# EasyEDA Pro project Type_C硬盘盒_2025-09-27_14-32-02.eprj, board PCB_ver3.0
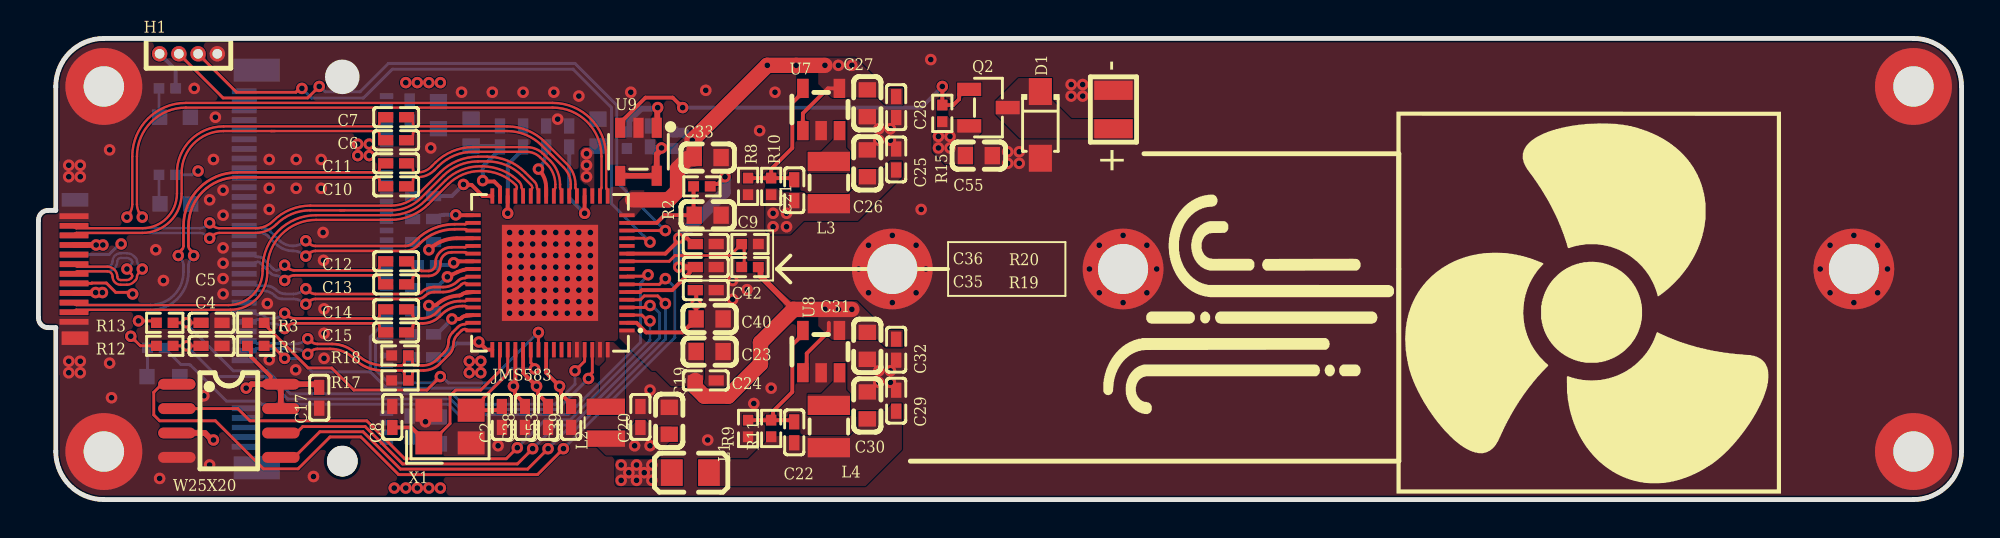
[diagram p7: board, top side]
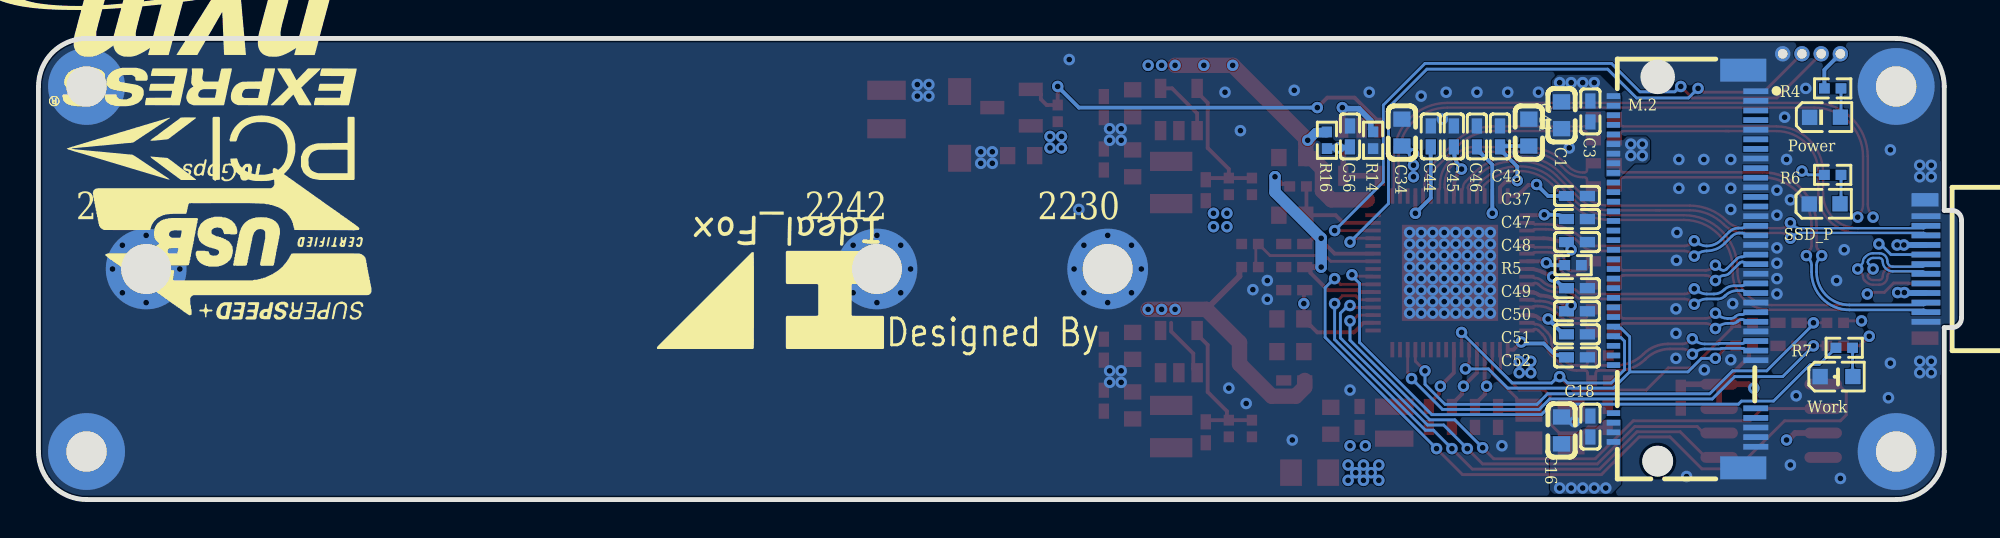
[diagram p8: board, bottom side, seen from below]

Outline 100 x 24 mm; copper layers: Top Layer, GND, VCC, Bottom Layer. Coordinates in mm from the lower left corner of the outline.
Outline path: 0,14.55 arc(0.15,14.9) 0.5,15.05 0.9,15.05 0.9,21.5 arc(1.63,23.27) 3.4,24 97.5,24 arc(99.27,23.27) 100,21.5 100,2.5 arc(99.27,0.73) 97.5,0 3.4,0 arc(1.63,0.73) 0.9,2.5 0.9,8.95 0.5,8.95 arc(0.15,9.1) 0,9.45 0,14.55
Stack: Top Layer 0.035mm / Dielectric 1 0.0711mm PP-006 er 4.1 / GND 0.018mm / Dielectric1 0.32mm FR-4 er 4.8 / VCC 0.018mm / Dielectric 2 0.0711mm PP-006 er 4.1 / Bottom Layer 0.035mm

## Design rules (mm)
net N_P1_TX_P: N_P1_TX
net N_P1_TX_N: N_P1_TX
net N_P0_TX_P: N_P0_TX
net N_P0_TX_N: N_P0_TX
net U_TX2_P: U_TX2
net U_TX2_N: U_TX2
net U_TX1_P: U_TX1
net U_TX1_N: U_TX1
net TX2_P: TX2
net TX2_N: TX2
net TX1_P: TX1
net TX1_N: TX1
net RX2_P: RX2
net RX2_N: RX2
net RX1_P: RX1
net RX1_N: RX1
net P1_TX_P: P1_TX
net P1_TX_N: P1_TX
net P1_RX_P: P1_RX
net P1_RX_N: P1_RX
net P0_TX_P: P0_TX
net P0_TX_N: P0_TX
net P0_RX_P: P0_RX
net P0_RX_N: P0_RX
net D_P: D
net D_N: D
net CLK_P: CLK
net CLK_N: CLK
spacing copperThickness2oz_1: track to track 0.12, other pairs 0 to 0.3
spacing copperThickness1oz_1: track to track 0.12, other pairs 0 to 0.3
spacing copperThickness1oz: track to track 0.12, other pairs 0 to 0.3
spacing Stitching GND: track to track 0.2, other pairs 0 to 0.3
spacing safeClearance (default): track to track 0.12, other pairs 0 to 0.3
track width copperThickness1oz_2 (default): min 0.1, default 0.1, max 5
differential pair DiffPairsRouting_85oum: width min 0.1, default 0.1, max 0.381; gap min 0.1, default 0.1
differential pair DiffPairsRouting_90oum (default): width min 0.1, default 0.1, max 0.381; gap min 0.1, default 0.1
via viaSize (default): diameter min 0.6, default 0.6, max 10; hole min 0.3, default 0.3, max 6.3
net GND uses Stitching GND

## Placement (name value [footprint] x y rotation side)
C1  -  [C0603]  20.8 20 270 bottom
C2  -  [C0402]  24.1 4.3 90 top
C3  -  [C0402]  19.3 20.2 90 bottom
C4  -  [C0402]  9 8 0 top
C5  -  [C0402]  9 9.2 0 top
C6  -  [C0402]  18.6 18.7 0 top
C7  -  [C0402]  18.6 19.9 0 top
C8  -  [C0402]  18.4 4.3 270 top
C9  -  [C0603]  34.8 14.8 180 top
C10  -  [C0402]  18.6 16.3 0 top
C11  -  [C0402]  18.6 17.5 0 top
C12  -  [C0402]  18.6 12.4 180 top
C13  -  [C0402]  18.6 11.2 180 top
C14  -  [C0402]  18.6 9.9 180 top
C15  -  [C0402]  18.6 8.7 180 top
C16  -  [C0603]  20.8 3.6 90 bottom
C17  -  [C0402]  14.6 5.3 90 top
C18  -  [C0402]  19.3 3.8 270 bottom
C19  -  [C0603]  32.8 4.1 270 top
C20  -  [C0402]  31.3 4.3 270 top
C21  -  [C0402]  39.3 16.1 90 top
C22  -  [C0402]  39.3 3.5 90 top
C23  -  [C0603]  34.9 7.7 180 top
C24  -  [C0402]  34.7 6.2 180 top
C25  -  [C0402]  44.6 17.7 270 top
C26  -  [C0603]  43.1 17.5 270 top
C27  -  [C0603]  43.1 20.62 90 top
C28  -  [C0402]  44.6 20.42 90 top
C29  -  [C0402]  44.6 5.14 270 top
C30  -  [C0603]  43.1 4.9 270 top
C31  -  [C0603]  43.1 8 90 top
C32  -  [C0402]  44.6 7.8 90 top
C33  -  [C0603]  34.8 17.8 180 top
C34  -  [C0603]  29.1 19.1 270 bottom
C35  -  [C0402]  34.7 12.1 180 top
C36  -  [C0402]  34.7 13.3 180 top
C37  -  [C0402]  20 15.8 0 bottom
C38  -  [C0402]  25.3 4.3 90 top
C39  -  [C0402]  27.7 4.3 90 top
C40  -  [C0603]  34.9 9.4 180 top
C41  -  [C0603]  22.5 19.1 270 bottom
C42  -  [C0402]  34.7 10.9 180 top
C43  -  [C0402]  24 18.9 270 bottom
C44  -  [C0402]  27.6 18.9 270 bottom
C45  -  [C0402]  26.4 18.9 270 bottom
C46  -  [C0402]  25.2 18.9 270 bottom
C47  -  [C0402]  20 14.6 0 bottom
C48  -  [C0402]  20 13.4 0 bottom
C49  -  [C0402]  20 11 0 bottom
C50  -  [C0402]  20 9.8 0 bottom
C51  -  [C0402]  20 8.6 0 bottom
C52  -  [C0402]  20 7.4 0 bottom
C53  -  [C0402]  26.5 4.3 90 top
C55  -  [C0603]  48.9 17.9 180 top
C56  -  [C0402]  31.8 18.9 90 bottom
D1  -  [SOD-123FL_L2.7-W1.8-LS3.8-RD]  52.1 19.5 270 top
Designator10  -  [M2_HOLE]  3.4 21.5 0 top
Designator17  -  [M2_HOLE]  97.5 21.5 0 top
Designator19  -  [M2_HOLE]  97.5 2.5 0 top
Designator20  -  [M2_HOLE]  3.4 2.5 0 top
H1  -  [HDR-TH_ZX-PZ1.0-1-4PZZ]  7.8 23.2 0 top
JMS583  -  [QFN-64_L8.0-W8.0-P0.40-TL-EP6.0]  26.6 11.8 180 top
L1  -  [L0805]  33.9 1.4 180 top
L2  -  [IND-SMD_L2.5-W2.0-VLS252012CX-150M]  29.5 4 90 top
L3  -  [IND-SMD_L2.5-W2.0_MHCHL2520]  41.1 16.5 90 top
L4  -  [IND-SMD_L2.5-W2.0_MHCHL2520]  41.1 3.8 90 top
M.2  -  [CONN-SMD_91302-225-067RCM]  14.4 12 270 bottom
NOREF  -  [Pad_ie502]  94.4 12 0 top
NOREF#2  -  [Pad_ie501]  56.4 12 0 top
NOREF#3  -  [Pad_ie498]  55.9 19.3 90 top
NOREF#4  -  [Pad_ie500]  44.4 12 0 top
NOREF#5  -  [Pad_ie499]  55.9 21.3 90 top
Power  -  [LED0603-RD_GREEN]  7.1 19.9 180 bottom
Q2  -  [SOT-23-3_L2.9-W1.3-P1.90-LS2.4-BR]  49.4 20.4 180 top
R1  -  [R0402]  11.3 8 180 top
R2  -  [R0402]  34.5 16.3 180 top
R3  -  [R0402]  11.3 9.2 180 top
R4  -  [R0402]  6.7 21.4 180 bottom
R5  -  [R0402]  20.2 12.2 180 bottom
R6  -  [R0402]  6.7 16.9 180 bottom
R7  -  [R0402]  6.1 7.9 180 bottom
R8  -  [R0402]  36.9 16.3 90 top
R9  -  [R0402]  36.9 3.7 90 top
R10  -  [R0402]  38.1 16.3 270 top
R11  -  [R0402]  38.1 3.7 270 top
R12  -  [R0402]  6.57 8 0 top
R13  -  [R0402]  6.57 9.2 0 top
R14  -  [R0402]  30.6 18.7 90 bottom
R15  -  [R0402]  47 20.1 90 top
R16  -  [R0402]  33 18.7 270 bottom
R17  -  [R0402]  18.8 6.2 180 top
R18  -  [R0402]  18.8 7.5 180 top
R19  -  [R0402]  37 12.1 180 top
R20  -  [R0402]  37 13.3 0 top
SSD_P  -  [LED0603-RD_GREEN]  7.12 15.39 180 bottom
U7  -  [SOT-23-5_L2.9-W1.6-P0.95-LS2.8-BL]  40.7 20.3 0 top
U8  -  [SOT-23-5_L2.9-W1.6-P0.95-LS2.8-BL]  40.7 7.7 0 top
U9  -  [SOT-23-5_L3.0-W1.5-P0.95-LS2.8-BL]  31.2 18.1 180 top
USB1  -  [USB-TYPE-C-SMD_U261-241N-4BS60]  1.88 12 90 bottom
W25X20  -  [SOIC-8_L5.0-W4.0-P1.27-LS6.0-BL]  9.9 4.1 270 top
Work  -  [LED0603-R-RD]  6.5 6.4 180 bottom
X1  -  [CRYSTAL-SMD_4P-L3.2-W2.5-BL]  21.4 3.8 0 top

## Footprints (pads in the part's own frame, mm; a bottom-side part is the same pattern mirrored in y, then rotated)
C0402
  rect 0.79x0.54 smd: 1(-0.545,0) 2(0.545,0)
C0603
  rect 0.8x0.9 smd: 1(-0.7,0) 2(0.7,0)
CONN-SMD_91302-225-067RCM
  rect 0.3x1.3 smd: 1(-9.25,3.7) 3(-8.75,3.7) 5(-8.25,3.7) 7(-7.75,3.7) 9(-7.25,3.7) 11(-6.75,3.7) 13(-6.25,3.7) 15(-5.75,3.7) 17(-5.25,3.7) 19(-4.75,3.7) 21(-4.25,3.7) 23(-3.75,3.7) 25(-3.25,3.7) 27(-2.75,3.7) 29(-2.25,3.7) 31(-1.75,3.7) 33(-1.25,3.7) 35(-0.75,3.7) 37(-0.25,3.7) 39(0.25,3.7) 41(0.75,3.7) 43(1.25,3.7) 45(1.75,3.7) 47(2.25,3.7) 49(2.75,3.7) 51(3.25,3.7) 53(3.75,3.7) 55(4.25,3.7) 57(4.75,3.7) 67(7.25,3.7) 69(7.75,3.7) 71(8.25,3.7) 73(8.75,3.7) 75(9.25,3.7)
  rect 0.3x0.7 smd: 2(-9,-3.7) 4(-8.5,-3.7) 6(-8,-3.7) 8(-7.5,-3.7) 10(-7,-3.7) 12(-6.5,-3.7) 14(-6,-3.7) 16(-5.5,-3.7) 18(-5,-3.7) 20(-4.5,-3.7) 22(-4,-3.7) 24(-3.5,-3.7) 26(-3,-3.7) 28(-2.5,-3.7) 30(-2,-3.7) 32(-1.5,-3.7) 34(-1,-3.7) 36(-0.5,-3.7) 38(0,-3.7) 40(0.5,-3.7) 42(1,-3.7) 44(1.5,-3.7) 46(2,-3.7) 48(2.5,-3.7) 50(3,-3.7) 52(3.5,-3.7) 54(4,-3.7) 56(4.5,-3.7) 58(5,-3.7) 68(7.5,-3.7) 70(8,-3.7) 72(8.5,-3.7) 74(9,-3.7)
  rect 1.2x2.4 smd: 76(-10.35,3.05) 77(10.35,3.05)
CRYSTAL-SMD_4P-L3.2-W2.5-BL
  rect 1.4x1.2 smd: 1(-1.1,-0.85) 2(1.1,-0.85) 3(1.1,0.85) 4(-1.1,0.85)
HDR-TH_ZX-PZ1.0-1-4PZZ
  round 0.8 hole 0.5: 1(-1.5,0) 2(-0.5,0) 3(0.5,0) 4(1.5,0)
IND-SMD_L2.5-W2.0-VLS252012CX-150M
  rect 0.85x2 smd: 1(-0.83,0) 2(0.83,0)
IND-SMD_L2.5-W2.0_MHCHL2520
  rect 1x2.2 smd: 1(-1.1,0) 2(1.1,0)
L0805
  rect 1.133x1.377 smd: 1(-0.966,0) 2(0.966,0)
LED0603-R-RD
  rect 0.8x0.8 smd: 1(0.851,0) 2(-0.851,0)
LED0603-RD_GREEN
  rect 0.8x0.8 smd: 1(-0.799,-0.004) 2(0.799,0.004)
M2_HOLE
  round 4 hole 2.1: 16(0,0)
Pad_ie498
  rect 1x2 smd: 1(0,0)
Pad_ie499
  rect 1x2 smd: 2(0,0)
Pad_ie500
  round 4.2 hole 2.6: 16(0,0)
Pad_ie501
  round 4.2 hole 2.6: 16(0,0)
Pad_ie502
  round 4.2 hole 2.6: 16(0,0)
QFN-64_L8.0-W8.0-P0.40-TL-EP6.0
  rect 0.8x0.2 smd: 1(-4,3) 2(-4,2.6) 3(-4,2.2) 4(-4,1.8) 5(-4,1.4) 6(-4,1) 7(-4,0.6) 8(-4,0.2) 9(-4,-0.2) 10(-4,-0.6) 11(-4,-1) 12(-4,-1.4) 13(-4,-1.8) 14(-4,-2.2) 15(-4,-2.6) 16(-4,-3) 33(4,-3) 34(4,-2.6) 35(4,-2.2) 36(4,-1.8) 37(4,-1.4) 38(4,-1) 39(4,-0.6) 40(4,-0.2) 41(4,0.2) 42(4,0.6) 43(4,1) 44(4,1.4) 45(4,1.8) 46(4,2.2) 47(4,2.6) 48(4,3)
  rect 0.2x0.8 smd: 17(-3,-4) 18(-2.6,-4) 19(-2.2,-4) 20(-1.8,-4) 21(-1.4,-4) 22(-1,-4) 23(-0.6,-4) 24(-0.2,-4) 25(0.2,-4) 26(0.6,-4) 27(1,-4) 28(1.4,-4) 29(1.8,-4) 30(2.2,-4) 31(2.6,-4) 32(3,-4) 49(3,4) 50(2.6,4) 51(2.2,4) 52(1.8,4) 53(1.4,4) 54(1,4) 55(0.6,4) 56(0.2,4) 57(-0.2,4) 58(-0.6,4) 59(-1,4) 60(-1.4,4) 61(-1.8,4) 62(-2.2,4) 63(-2.6,4) 64(-3,4)
  rect 5x5 smd: 65(0,0)
R0402
  rect 0.566x0.54 smd: 1(-0.433,0) 2(0.433,0)
SOD-123FL_L2.7-W1.8-LS3.8-RD
  rect 1.4x1.2 smd: 1(-1.735,0) 2(1.735,0)
SOIC-8_L5.0-W4.0-P1.27-LS6.0-BL
  oval 0.569x1.95 smd: 1(-1.905,-2.705) 2(-0.635,-2.705) 3(0.635,-2.705) 4(1.905,-2.705) 5(1.905,2.705) 6(0.635,2.705) 7(-0.635,2.705) 8(-1.905,2.705)
SOT-23-3_L2.9-W1.3-P1.90-LS2.4-BR
  rect 1.25x0.7 smd: 1(1,-0.95) 2(1,0.95) 3(-1,0)
SOT-23-5_L2.9-W1.6-P0.95-LS2.8-BL
  rect 0.6x1 smd: 1(-0.95,-1.1) 2(0,-1.1) 3(0.95,-1.1) 4(0.95,1.1) 5(-0.95,1.1)
SOT-23-5_L3.0-W1.5-P0.95-LS2.8-BL
  rect 0.532x1.045 smd: 1(-0.95,-1.25) 2(0,-1.25) 3(0.95,-1.25) 4(0.95,1.25) 5(-0.95,1.25)
USB-TYPE-C-SMD_U261-241N-4BS60
  rect 0.7x1.4 smd far side: 1(-3.6,0.025)
  rect 0.7x1.4 smd: 2(3.6,0.025)
  rect 0.3x1.5 smd: A1(2.75,-0.025) A2(2.25,-0.025) A3(1.75,-0.025) A4(1.25,-0.025) A5(0.75,-0.025) A6(0.25,-0.025) A7(-0.25,-0.025) A8(-0.75,-0.025) A9(-1.25,-0.025) A10(-1.75,-0.025) A11(-2.25,-0.025) A12(-2.75,-0.025)
  rect 0.3x1.5 smd far side: B1(-2.75,-0.025) B2(-2.25,-0.025) B3(-1.75,-0.025) B4(-1.25,-0.025) B5(-0.75,-0.025) B6(-0.25,-0.025) B7(0.25,-0.025) B8(0.75,-0.025) B9(1.25,-0.025) B10(1.75,-0.025) B11(2.25,-0.025) B12(2.75,-0.025)

## Nets
3V3: C22.1 C29.2 C30.2 L1.1 L4.1 R11.2
AVDDL: C19.2 C20.2 C21.1 C25.2 C26.2 C40.2 C41.2 C42.2 C43.2 C44.2 C45.2 C46.2 C47.2 C48.2 C49.2 C50.2 C51.2 C52.2 C53.2 JMS583.2 JMS583.20 JMS583.25 JMS583.30 JMS583.31 JMS583.33 JMS583.36 JMS583.40 JMS583.43 JMS583.46 JMS583.49 JMS583.53 L2.1 L3.1 R10.2
GND: C1.2 C2.1 C3.1 C4.2 C5.2 C8.1 C9.1 C16.2 C17.1 C18.1 C19.1 C20.1 C23.1 C24.1 C25.1 C26.1 C27.1 C28.1 C29.1 C30.1 C31.1 C32.1 C33.1 C34.1 C35.1 C36.1 C37.1 C38.1 C39.1 C40.1 C41.1 C42.1 C43.1 C44.1 C45.1 C46.1 C47.1 C48.1 C49.1 C50.1 C51.1 C52.1 C53.1 C55.1 C56.2 D1.2 Designator10.16 Designator17.16 Designator19.16 Designator20.16 H1.4 JMS583.60 JMS583.63 JMS583.65 M.2.1 M.2.3 M.2.9 M.2.15 M.2.21 M.2.27 M.2.33 M.2.39 M.2.45 M.2.51 M.2.57 M.2.71 M.2.73 M.2.75 M.2.76 M.2.77 NOREF.16 NOREF#2.16 NOREF#4.16 NOREF#5.2 Power.1 R3.2 R5.2 R8.1 R9.1 R14.1 R17.2 R18.2 R20.2 SSD_P.1 U7.2 U8.2 U9.2 USB1.1 USB1.2 USB1.A1 USB1.A12 USB1.B1 USB1.B12 W25X20.4 Work.2 X1.2 X1.4
VBUS: C23.2 C24.2 C27.2 C28.2 C31.2 C32.2 C33.2 C55.2 JMS583.1 JMS583.16 Q2.2 R15.1 R16.1 R19.1 U7.1 U7.4 U8.1 U8.4 USB1.A4 USB1.A9 USB1.B4 USB1.B9
VCC: C17.2 C34.2 C35.2 C36.2 C37.2 C38.2 C39.2 H1.1 JMS583.6 JMS583.11 JMS583.19 JMS583.32 JMS583.52 JMS583.56 R1.2 R2.1 R4.1 W25X20.3 W25X20.7 W25X20.8
CC1: C4.1 JMS583.62 R12.2
CC2: C5.1 JMS583.61 R13.2
CLK_N: JMS583.47 M.2.53 R18.1
CLK_P: JMS583.48 M.2.55 R17.1
D_N: JMS583.17 USB1.A7 USB1.B7
D_P: JMS583.18 USB1.A6 USB1.B6
GPIO0: JMS583.3 W25X20.2
GPIO1: JMS583.4 W25X20.6
GPIO2: JMS583.5 W25X20.5
GPIO3: JMS583.7 W25X20.1
GPIO4: JMS583.8 R7.1
GPIO6: JMS583.10 R19.2 R20.1
GPIO8: H1.3 JMS583.13
GPIO9: H1.2 JMS583.14
LXO: JMS583.64 L2.2
M.2_3V3: C1.1 C3.2 C16.1 C18.2 L1.2 M.2.2 M.2.4 M.2.12 M.2.14 M.2.16 M.2.18 M.2.70 M.2.72 M.2.74 R6.1
N_P0_TX_N: C14.2 M.2.47
N_P0_TX_P: C15.2 M.2.49
N_P1_TX_N: C12.2 M.2.35
N_P1_TX_P: C13.2 M.2.37
P0_RX_N: JMS583.41 M.2.41
P0_RX_P: JMS583.42 M.2.43
P0_TX_N: C14.1 JMS583.44
P0_TX_P: C15.1 JMS583.45
P1_RX_N: JMS583.34 M.2.29
P1_RX_P: JMS583.35 M.2.31
P1_TX_N: C12.1 JMS583.37
P1_TX_P: C13.1 JMS583.38
PCIE_CLK: JMS583.55 M.2.52 R3.1
PCIE_RST: JMS583.54 M.2.50 R1.1
RST: C9.2 JMS583.15 R2.2
RX1_N: JMS583.27 USB1.A3
RX1_P: JMS583.26 USB1.A2
RX2_N: JMS583.28 USB1.B3
RX2_P: JMS583.29 USB1.B2
TX1_N: C6.2 JMS583.22
TX1_P: C7.2 JMS583.21
TX2_N: C11.2 JMS583.23
TX2_P: C10.2 JMS583.24
U_CC1: R12.1 USB1.A5
U_CC2: R13.1 USB1.B5
U_TX1_N: C6.1 USB1.B10
U_TX1_P: C7.1 USB1.B11
U_TX2_N: C11.1 USB1.A10
U_TX2_P: C10.1 USB1.A11
XIN: C8.2 JMS583.50 X1.1
XOUT: C2.2 JMS583.51 X1.3
$1N3363: R6.2 SSD_P.2
$1N3561: R7.2 Work.1
$1N4495: JMS583.39 R5.1
$1N10279: C22.2 R9.2 R11.1 U8.5
$1N10317: L4.2 U8.3
$1N10953: Power.2 R4.2
$1N11538: L3.2 U7.3
$1N11540: C21.2 R8.2 R10.1 U7.5
$1N22897: R14.2 U9.1
$1N22946: C56.1 R16.2 U9.4 U9.5
$1N23051: Q2.1 R15.2 U9.3
$1N23334: D1.1 NOREF#3.1 Q2.3

Pads without a net: JMS583 9 12 57 58 59; M.2 5 6 7 8 10 11 13 17 19 20 22 23 24 25 26 28 30 32 34 36 38 40 42 44 46 48 54 56 58 67 68 69; USB1 A8 B8

## Via types
v1: diameter 0.6, hole 0.3, Top Layer to Bottom Layer, 288 vias

## Routing (per net, layer and track width the routed paths; a pad name or vN(x,y) marks a point on that pad's centre or on a via; arc(x,y) is an arc through that point)
AVDDL: length 97.2
  Top Layer w0.2: JMS583.33 21.7,14.8 v1(21.7,14.82) ; JMS583.2 31.1,9.2 31.6,8.7 33.5,8.7 33.85,9.05 33.9,9.05 34.2,9.35 C40.2 34.2,10.86 C42.2 ; v1(20.3,10.1) 20.57,10.1 arc(20.65,10.11) 20.71,10.15 arc(21.26,10.49) 21.89,10.62 arc(21.96,10.64) 22.02,10.68 arc(22.09,10.72) 22.17,10.75 JMS583.43 ; C53.2 26.5,4.97 25.98,5.49 25.98,5.82 v1(25.9,5.9) 25.2,6.6 JMS583.53 ; JMS583.31 24,16.25 23.7,16.55 23.15,16.55 v1(23.1,16.6) ; JMS583.46 22.17,9.55 arc(22.08,9.52) 22.01,9.47 arc(21.95,9.42) 21.87,9.4 v1(21.5,9.4) ; v1(28.4,14.9) JMS583.20 ; v1(22.9,8.2) 23.3,7.8 JMS583.49 ; JMS583.36 21.75,13.6 arc(20.96,13.44) v1(20.3,13) ; v1(24.4,14.9) JMS583.30 ; v1(21.26,11.59) 21.77,11.83 arc(21.93,11.9) 22.1,11.95 22.3,12 JMS583.40 ; JMS583.25 26.4,16.23 arc(26.3,16.76) v1(26,17.2)
  VCC w0.6: v1(25.9,5.9) 26.08,6.08 26.1,6.08 26.52,6.5 26.52,7.1 26.1,7.52 24.28,7.52 22.9,8.9 v1(22.9,8.2)
  VCC w0.8: v1(31,2.8) v1(31.8,2.8) ; 21.15,10.85 21.05,10.85 v1(20.3,10.1) ; v1(23.1,16.6) 23.1,15.56 23.68,14.98 ; v1(34.2,10.2) 36.05,8.35 36.05,8.25 ; 20.25,11.75 20.41,11.59 ; 26.1,15.22 26,15.32 v1(26,17.2) ; v1(21.5,9.4) 22.05,9.95
  VCC w1.5: 38.5,14.7 38.5,10.7 31.4,3.6
  VCC w1.8: 20.41,11.59 22.9,9.1 22.9,8.9 ; v1(20.3,13) 20.3,13.6 21.52,14.82 v1(21.7,14.82) 21.86,14.98 23.68,14.98 23.92,15.22 29.07,15.22 29.17,15.32 34.97,15.32 35.59,14.7 38.5,14.7 ; 20.25,11.75 20.25,12.95
  Bottom Layer w0.2: 23.95,18.4 23.95,18.19 23.1,17.33 v1(23.1,16.6) ; 23.95,18.4 C41.2 ; 23.95,18.4 C43.2 ; C48.2 20.41,13.26 arc(20.33,13.14) v1(20.3,13) ; v1(28.4,14.9) 27.6,15.7 C44.2 ; v1(24.4,14.9) 24.4,17.43 25.2,18.23 C46.2 ; v1(21.7,14.82) 21.08,14.82 arc(20.79,14.76) C47.2 ; v1(22.9,8.2) 22.82,8.12 21.72,8.12 21.12,7.52 20.66,7.52 C52.2 ; C45.2 26.4,18.17 arc(26.3,17.64) v1(26,17.2) ; v1(21.5,9.4) 20.81,8.71 arc(20.69,8.63) C51.2 ; v1(21.26,11.59) 20.76,11.09 arc(20.66,11.02) C49.2
  vias: v1(38.2,14.9) v1(38.2,14.2) v1(38.9,14.9) v1(38.9,14.2)
GND:
  vias: v1(1.58,17.4) v1(1.58,16.8) v1(1.58,7.2) v1(1.58,6.6) v1(2.17,17.4) v1(2.17,16.8) v1(2.17,7.2) v1(2.17,6.6) v1(3.7,18.2) v1(3.7,7.1) v1(3.8,5.3) v1(6.1,13) v1(6.3,1.1) v1(6.5,11.4) v1(8.1,21.4) v1(8.6,5.4) v1(8.9,15.6) v1(8.9,1.8) v1(9.1,17.7) v1(9.2,19.9) v1(9.6,16.1) v1(9.6,14.8) v1(9.6,13.1) v1(9.6,12.3) v1(9.6,11.5) v1(9.6,10.7) v1(11.9,10.2) v1(12,17.7) v1(12,16.2) v1(12,15.1) v1(12,7.28) v1(13.4,17.7) v1(13.4,16.2) v1(13.38,6.75) v1(14.3,1.2) v1(14.7,17.7) v1(14.7,16.2) v1(14.8,13.9) v1(14.83,12.45) v1(14.85,9.92) v1(14.85,8.65) v1(14.85,7.35) v1(20.12,4.05) v1(20.4,18.3) v1(22,21.2) v1(23.6,21.2) v1(23.9,2.8) v1(24.5,13.9) v1(24.5,13.3) v1(24.5,12.7) v1(24.5,12.1) v1(24.5,11.5) v1(24.5,10.9) v1(24.5,10.3) v1(24.5,9.7) v1(25.1,13.9) v1(25.1,13.3) v1(25.1,12.7) v1(25.1,12.1) v1(25.1,11.5) v1(25.1,10.9) v1(25.1,10.3) v1(25.1,9.7) v1(25.2,21.2) v1(25.7,13.9) v1(25.7,13.3) v1(25.7,12.7) v1(25.7,12.1) v1(25.7,11.5) v1(25.7,10.9) v1(25.7,10.3) v1(25.7,9.7) v1(26.3,13.9) v1(26.3,13.3) v1(26.3,12.7) v1(26.3,12.1) v1(26.3,11.5) v1(26.3,10.9) v1(26.3,10.3) v1(26.3,9.7) v1(26.8,21.2) v1(26.9,13.9) v1(26.9,13.3) v1(26.9,12.7) v1(26.9,12.1) v1(26.9,11.5) v1(26.9,10.9) v1(26.9,10.3) v1(26.9,9.7) v1(27,19.8) v1(27.5,13.9) v1(27.5,13.3) v1(27.5,12.7) v1(27.5,12.1) v1(27.5,11.5) v1(27.5,10.9) v1(27.5,10.3) v1(27.5,9.7) v1(28.1,21) v1(28.1,13.9) v1(28.1,13.3) v1(28.1,12.7) v1(28.1,12.1) v1(28.1,11.5) v1(28.1,10.9) v1(28.1,10.3) v1(28.1,9.7) v1(28.7,13.9) v1(28.7,13.3) v1(28.7,12.7) v1(28.7,12.1) v1(28.7,11.5) v1(28.7,10.9) v1(28.7,10.3) v1(28.7,9.7) v1(30.8,21.2) v1(31.8,5.7) v1(34.7,21.3) v1(34.8,3.1) v1(36.1,11.4) v1(36.1,10.42) v1(36.85,10.92) v1(37.2,5) v1(37.5,19.2) v1(38.1,5.8) v1(38.3,21.2) v1(42.65,12) v1(43.16,13.24) v1(43.16,10.76) v1(43.7,19.3) v1(43.7,18.7) v1(43.7,6.7) v1(43.7,6.1) v1(44.3,19.3) v1(44.3,18.7) v1(44.3,6.7) v1(44.3,6.1) v1(44.4,13.75) v1(44.4,10.25) v1(45.64,13.24) v1(45.64,10.76) v1(45.9,15.1) v1(46.15,12) v1(46.4,22.9) v1(50.4,18.1) v1(50.4,17.5) v1(51,18.1) v1(51,17.5) v1(53.7,21.6) v1(53.7,21) v1(54.3,21.6) v1(54.3,21) v1(54.65,12) v1(55.16,13.24) v1(55.16,10.76) v1(56.4,13.75) v1(56.4,10.25) v1(57.64,13.24) v1(57.64,10.76) v1(58.15,12) v1(92.65,12) v1(93.16,13.24) v1(93.16,10.76) v1(94.4,13.75) v1(94.4,10.25) v1(95.64,13.24) v1(95.64,10.76) v1(96.15,12)
VBUS: length 109.8
  Top Layer w0.2: 41.1,9.2 41.1,8.75 39.95,7.6 39.95,6.8 U8.1 ; U7.4 41.05,21.4 39.75,20.1 U7.1
  Top Layer w0.3: 39.27,9.9 37.55,11.62 37.55,11.99 R19.1 ; v1(3.33,10.78) 3.3,10.75 USB1.A9 ; v1(3.35,13.25) v1(3,13.25) USB1.A4
  Top Layer w0.8: 30.9,15.6 32.77,15.6 33.23,16.07 33.23,17.22 33.77,17.75 34.1,17.75 C33.2 ; v1(42.3,9.9) v1(41.6,9.9) v1(40.9,9.9) 39.27,9.9 37.54,8.17 37.54,7.06 35.87,5.38 34.62,5.38 34.16,5.85 C24.2 ; v1(40.9,22.6) v1(39.4,22.6) v1(37.9,22.6) v1(34,18.7) 34.1,18.6 34.1,17.85
  VCC w1.3: v1(3,13.25) 3.25,13 3.25,11.05 v1(2.97,10.78) ; 42.3,22.6 v1(37.9,22.6) 30.63,22.6 30.33,22.9 18.67,22.9 14.57,18.8 7.09,18.8 2.97,14.69 2.97,13.25
  VCC w1.5: v1(42.3,22.6) 43.1,22.6 v1(46.8,18.9) 47.1,18.6 ; v1(42.3,22.6) 42.65,22.6 ; v1(42.3,22.6) v1(41.6,22.6)
  VCC w2: 41.6,9.9 40.9,10.6 40.9,13.35 41.6,14.05 41.6,22.6
  Bottom Layer w0.3: USB1.A4 v1(3,13.25) v1(3.35,13.25) ; USB1.A9 3.3,10.75 v1(3.33,10.78)
  Bottom Layer w0.5: 33,19.13 33,19.12 33.02,19.1 33.57,19.1 33.97,18.7 v1(34,18.7)
  vias: v1(46.8,18.3) v1(47.4,18.9) v1(47.4,18.3)
VCC: length 119.4
  Top Layer w0.2: JMS583.6 31.28,10.8 31.38,10.9 32.96,10.9 33.86,11.81 33.86,11.93 34.03,12.1 C35.2 ; JMS583.11 32.6,12.8 33.4,13.6 33.41,13.59 33.74,13.59 33.86,13.48 33.86,13.47 34.03,13.3 C36.2 ; v1(22.1,16.4) 22.12,16.38 22.52,16.38 23.1,15.8 JMS583.32 ; JMS583.52 24.8,6.11 24.7,6.01 v1(24.7,5.9) 24.78,5.82 24.78,5.49 25.3,4.97 C38.2 ; 10.87,8 10.88,8 11.05,7.83 11.05,7.43 12.07,6.41 12.07,6.17 12.24,6 W25X20.8 ; R2.1 35.06,16.43 35.33,16.43 v1(35.7,16.8) ; JMS583.56 26.4,6.6 v1(27.1,5.9) 27.18,5.82 27.18,5.49 27.7,4.97 C39.2
  Top Layer w0.3: 12.24,6 11.09,6 10.88,5.8 v1(10.8,5.8) ; W25X20.7 W25X20.8 14.48,6 14.6,5.89 C17.2 ; W25X20.3 8.66,3.47 9.02,3.1 v1(9.1,3.1) ; v1(33.3,12.1) 34.03,12.1
  GND w0.8: v1(10.8,5.8) 11.32,5.28 ; 11.32,5.28 21.08,5.28 v1(22.4,6.6) v1(23,7.2) ; 11.32,5.28 9.14,3.1 v1(9.1,3.1)
  VCC w0.3: v1(9.1,3.1) 2.06,10.14 2.06,15.07 6.3,19.31 6.3,23.2
  VCC w0.8: v1(24.7,5.9) 24.52,5.72 24.52,5.08 ; v1(23,6.6) 24.52,5.08 ; 24.52,5.08 26.28,5.08 v1(27.1,5.9) ; v1(28.5,17.4) 35.1,17.4 v1(35.7,16.8) ; 21.15,17.35 v1(22.1,16.4)
  VCC w1: v1(28.5,16.8) v1(28.5,17.4) v1(28.5,18)
  VCC w1.5: v1(28.5,17.4) 27.43,18.47 22.26,18.47 18.1,14.31 18.1,9.7 20.03,7.77 21.18,7.77 21.92,7.03 22.57,7.03 22.7,6.9
  Bottom Layer w0.2: H1.1 7.13,22.37 7.13,21.4 ; v1(22.1,16.4) 21.5,15.8 C37.2 ; 28.61,18 28.71,18.1 28.8,18.1 C34.2 arc(28.92,18.36) 28.76,18.26 v1(28.5,18) 28.61,18
  Bottom Layer w0.6: v1(33.3,12.1) v1(33.3,13.6) 35.7,16 v1(35.7,16.8)
  vias: v1(22.4,7.2)
CC1: length 26
  Top Layer w0.15: JMS583.62 28.8,6.62 28.6,6.42 v1(28.6,6.3) ; C4.1 v1(7.7,8) R12.2
  Bottom Layer w0.15: v1(28.6,6.3) 26.99,4.69 21.96,4.69 21.42,5.23 12.97,5.23 11.8,6.4 9.3,6.4 v1(7.7,8)
CC2: length 25.9
  Top Layer w0.15: C5.1 v1(7.7,9.2) R13.2 ; JMS583.61 28.4,7.2 v1(27.9,6.7)
  Bottom Layer w0.15: v1(7.7,9.2) 7.7,9.13 10.13,6.7 11.9,6.7 13.09,5.5 21.53,5.5 22.07,4.96 26.86,4.96 27.9,6 v1(27.9,6.7)
CLK_N: length 14.4
  Top Layer w0.14: JMS583.47 22.35,9.2 arc(22.3,9.19) 22.27,9.17 arc(22.23,9.14) 22.18,9.13 arc(21.98,9.09) 21.81,8.98 21.53,8.69 arc(21.37,8.46) 21.32,8.18 arc(21.26,7.91) 21.11,7.67 20.72,7.28 arc(20.38,7.06) 19.98,6.98 19.59,6.98 arc(19.53,6.99) 19.49,7.02 arc(19.46,7.07) 19.45,7.12 19.45,7.16 arc(19.42,7.29) 19.35,7.4 19.25,7.5 R18.1 19.22,7.5 19.1,7.38 arc(19.04,7.29) 19.02,7.18 19.02,7.12 arc(19.01,7.07) 18.98,7.02 arc(18.93,6.99) 18.88,6.98 17.97,6.98 ; 17.9,6.98 17.97,6.98 ; 17.97,6.98 arc(17.2,7.13) 16.54,7.57 arc(15.96,7.96) 15.26,8.1 14.5,8.1 arc(14.33,8.14) 14.18,8.23 14.07,8.34 arc(14.04,8.36) v1(14,8.37)
  Bottom Layer w0.14: 11.4,8.13 12.57,8.13 arc(12.59,8.13) 12.61,8.11 arc(12.62,8.1) 12.64,8.1 13.35,8.1 arc(13.66,8.16) 13.93,8.34 arc(13.96,8.36) v1(14,8.37) ; 11.4,8.13 arc(11.33,8.15) 11.26,8.19 ; 11.4,8.13 arc(11.33,8.15) 11.26,8.19 ; M.2.53 11.11,8.25 arc(11.19,8.23) 11.26,8.19
CLK_P: length 14.4
  Top Layer w0.14: JMS583.48 22.35,8.8 arc(22.3,8.81) 22.27,8.83 arc(22.23,8.86) 22.18,8.87 arc(22.08,8.85) 22,8.79 21.79,8.59 arc(21.63,8.35) 21.58,8.08 arc(21.52,7.8) 21.37,7.57 20.87,7.07 arc(20.48,6.81) 20.02,6.72 19.59,6.72 arc(19.53,6.71) 19.49,6.68 arc(19.46,6.63) 19.45,6.58 19.45,6.54 arc(19.42,6.41) 19.35,6.3 19.25,6.2 R17.1 19.22,6.2 19.1,6.32 arc(19.04,6.41) 19.02,6.52 19.02,6.58 arc(19.01,6.63) 18.98,6.68 arc(18.93,6.71) 18.88,6.72 17.9,6.72 ; 16.42,7.32 16.44,7.31 ; 16.42,7.32 arc(15.84,7.71) 15.16,7.84 14.5,7.84 arc(14.33,7.8) 14.18,7.7 14.07,7.6 arc(14.04,7.58) v1(14,7.57) ; 16.42,7.32 arc(16.43,7.32) 16.44,7.31 ; 16.44,7.31 arc(17.09,6.87) 17.86,6.72
  Bottom Layer w0.14: 11.26,7.81 11.24,7.79 arc(11.23,7.77) 11.22,7.75 ; 11.26,7.81 11.27,7.82 arc(11.33,7.86) 11.39,7.87 11.4,7.87 ; 11.26,7.81 arc(11.19,7.77) 11.11,7.75 M.2.55 ; 11.26,7.81 arc(11.33,7.85) 11.4,7.87 ; 11.4,7.87 12.46,7.87 arc(12.48,7.87) 12.5,7.86 arc(12.52,7.84) 12.54,7.84 13.35,7.84 arc(13.66,7.78) 13.93,7.6 arc(13.96,7.58) v1(14,7.57)
D_N: length 44
  Top Layer w0.125: JMS583.17 29.6,16.05 arc(29.59,16.1) 29.56,16.14 arc(29.53,16.18) 29.52,16.23 29.52,17.86 arc(28.71,19.83) 26.74,20.64 7.66,20.64 arc(5.69,19.83) 4.88,17.86 4.88,15.37 arc(4.81,15.04) 4.62,14.75 arc(4.61,14.73) v1(4.6,14.7) ; v1(4.6,12) arc(4.61,11.97) 4.62,11.95 4.84,11.73 arc(4.87,11.69) 4.88,11.64 arc(4.87,11.59) 4.84,11.55 4.8,11.51 arc(4.71,11.45) 4.6,11.42 4.28,11.42 arc(4.15,11.48) 4.1,11.6 arc(3.95,11.97) 3.58,12.12 2.03,12.12 arc(1.94,12.16) 1.9,12.25
  VCC w0.125: v1(4.6,12) arc(4.61,12.03) 4.62,12.05 arc(4.81,12.34) 4.88,12.67 4.88,14.2 arc(4.84,14.38) 4.74,14.53 4.62,14.65 arc(4.61,14.67) v1(4.6,14.7)
  Bottom Layer w0.125: v1(4.6,12) arc(4.61,12.03) 4.62,12.05 4.84,12.27 arc(4.87,12.31) 4.88,12.36 arc(4.87,12.41) 4.84,12.45 4.8,12.49 arc(4.71,12.55) 4.6,12.58 4.28,12.58 arc(4.15,12.52) 4.1,12.4 arc(3.95,12.03) 3.58,11.88 2.03,11.88 arc(1.94,11.84) 1.9,11.75
D_P: length 44
  Top Layer w0.125: JMS583.18 29.2,16.05 arc(29.21,16.1) 29.24,16.14 arc(29.27,16.18) 29.28,16.23 29.28,17.86 arc(28.53,19.66) 26.74,20.4 7.66,20.4 arc(5.87,19.66) 5.12,17.86 5.12,15.37 arc(5.19,15.04) 5.38,14.75 arc(5.39,14.73) v1(5.4,14.7) ; v1(5.4,12) arc(5.39,11.97) 5.38,11.95 5.19,11.76 arc(5.14,11.68) 5.12,11.59 arc(5.1,11.49) 5.05,11.41 4.97,11.33 arc(4.8,11.22) 4.6,11.18 4.28,11.18 arc(3.98,11.3) 3.86,11.6 arc(3.77,11.8) 3.58,11.88 2.03,11.88 arc(1.94,11.84) 1.9,11.75
  VCC w0.125: v1(5.4,14.7) arc(5.39,14.67) 5.38,14.65 5.26,14.53 arc(5.16,14.38) 5.12,14.2 5.12,12.67 arc(5.19,12.34) 5.38,12.05 arc(5.39,12.03) v1(5.4,12)
  Bottom Layer w0.125: v1(5.4,12) arc(5.39,12.03) 5.38,12.05 5.19,12.24 arc(5.14,12.32) 5.12,12.41 arc(5.1,12.51) 5.05,12.59 4.97,12.67 arc(4.8,12.78) 4.6,12.82 4.28,12.82 arc(3.98,12.7) 3.86,12.4 arc(3.77,12.2) 3.58,12.12 2.03,12.12 arc(1.94,12.16) 1.9,12.25
GPIO0: length 30.6
  Top Layer w0.15: v1(31.8,9.3) 31.68,9.3 31.38,9.6 JMS583.3 ; W25X20.2 10.36,4.73 11,4.1 17.07,4.1 19.05,2.12 24.33,2.12 v1(24.9,2.7)
  Bottom Layer w0.15: v1(31.8,9.3) 31.8,8.3 27.65,4.15 26.35,4.15 v1(24.9,2.7)
GPIO1: length 26.5
  Top Layer w0.15: W25X20.6 13.41,3.47 13.74,3.8 16.99,3.8 18.94,1.86 24.91,1.86 v1(25.7,2.65) ; JMS583.4 31.48,10 31.49,10.01 31.71,10.01 v1(31.8,10.1)
  Bottom Layer w0.15: v1(31.8,10.1) 31.9,10.1 32.3,9.7 32.3,8.41 27.77,3.88 26.93,3.88 v1(25.7,2.65)
GPIO2: length 28.3
  Top Layer w0.15: v1(32.6,10.2) 32.2,10.6 31.5,10.6 31.3,10.4 JMS583.5 ; v1(26.5,2.65) 25.44,1.58 18.82,1.58 16.88,3.53 14.63,3.53 13.3,2.19 W25X20.5
  Bottom Layer w0.15: v1(26.5,2.65) 27.46,3.61 27.88,3.61 32.6,8.33 v1(32.6,10.2)
GPIO3: length 40.7
  Top Layer w0.15: JMS583.7 32.29,11.2 32.59,11.5 v1(32.6,11.5) ; W25X20.1 6.42,6 6,5.58 6,4.41 6.3,4.1 9.2,4.1 11.7,1.6 13.5,1.6 15.16,3.26 16.77,3.26 18.73,1.3 25.95,1.3 v1(27.3,2.65)
  Bottom Layer w0.15: v1(32.6,11.5) 32.62,11.5 33.09,11.03 33.09,8.44 v1(27.3,2.65)
GPIO4: length 32.6
  Top Layer w0.15: v1(31.7,11.7) 31.62,11.62 30.62,11.62 JMS583.8
  Bottom Layer w0.15: R7.1 7.41,7.03 7.84,7.03 7.87,7 7.9,7 9.78,5.12 11.44,5.12 11.6,4.97 21.3,4.97 21.85,4.42 27.54,4.42 31.3,8.18 31.3,11.25 31.7,11.65 v1(31.7,11.7)
GPIO6: length 7.6
  Top Layer w0.15: R19.2 36.7,12.23 36.7,13.17 R20.1 36.55,13.3 35.95,12.7 33.1,12.7 32.8,12.4 JMS583.10
GPIO8: length 33.2
  Top Layer w0.15: v1(31.8,13.4) 31.68,13.4 31.48,13.6 JMS583.13 ; v1(13.7,21.4) 13.59,21.4 13.39,21.2 10.3,21.2 H1.3
  Bottom Layer w0.15: v1(13.7,21.4) 14.2,20.9 16.9,20.9 18.4,22.4 27.8,22.4 29.8,20.4 29.8,15.4 v1(31.8,13.4)
GPIO9: length 35.2
  Top Layer w0.15: JMS583.14 v1(32.6,14) ; v1(14.6,21.5) 14,20.9 9.6,20.9 H1.2
  Bottom Layer w0.15: v1(32.6,14) 30.07,16.53 30.07,20.53 27.9,22.7 18.2,22.7 16.72,21.22 14.91,21.22 14.64,21.5 v1(14.6,21.5)
M.2_3V3: length 9.5
  VCC w0.15: v1(8.3,17.1) 15.7,17.1 16.3,17.7
  Bottom Layer w0.15: v1(8.3,17.1) 8.18,17.1 7.98,16.9 7.13,16.9
  vias: v1(16.6,18.5) v1(16.6,17.9) v1(17.2,18.5) v1(17.2,17.9) v1(18.5,0.6) v1(19.1,21.7) v1(19.1,0.6) v1(19.7,21.7) v1(19.7,0.6) v1(20.3,21.7) v1(20.3,0.6) v1(20.9,21.7) v1(20.9,0.6) v1(30.3,1.8) v1(30.3,1) v1(30.7,1.4) v1(31.1,1.8) v1(31.1,1) v1(31.5,1.4) v1(31.9,1.8) v1(31.9,1)
N_P0_TX_N: length 8.2
  Top Layer w0.14: 17.87,9.77 17.96,9.86 arc(18.01,9.89) 18.06,9.9 arc(17.94,9.88) 17.84,9.81 17.8,9.77 arc(17.75,9.69) 17.73,9.61 17.73,9.57 arc(17.72,9.52) 17.69,9.47 arc(17.64,9.44) 17.59,9.43 13.3,9.43 arc(13.13,9.47) 12.98,9.56 12.87,9.67 ; 12.87,9.67 arc(12.84,9.69) v1(12.8,9.7) arc(12.84,9.69) 12.87,9.67
  Bottom Layer w0.14: M.2.47 11.11,9.75 arc(11.19,9.73) 11.26,9.69 arc(11.33,9.65) 11.41,9.63 11.51,9.63 arc(11.64,9.6) 11.75,9.53 arc(11.86,9.46) 11.99,9.43 12.17,9.43 arc(12.46,9.49) 12.71,9.65 12.73,9.67 arc(12.76,9.69) v1(12.8,9.7)
N_P0_TX_P: length 8.2
  Top Layer w0.14: 17.87,8.83 17.96,8.74 arc(18.01,8.71) 18.06,8.7 arc(17.94,8.72) 17.84,8.79 17.8,8.83 arc(17.75,8.91) 17.73,8.99 17.73,9.03 arc(17.72,9.08) 17.69,9.13 arc(17.64,9.16) 17.59,9.17 13.3,9.17 arc(13.13,9.13) 12.98,9.03 12.87,8.93 ; 12.87,8.93 arc(12.84,8.91) v1(12.8,8.9) arc(12.84,8.91) 12.87,8.93
  Bottom Layer w0.14: M.2.49 11.11,9.25 arc(11.19,9.27) 11.26,9.31 arc(11.33,9.35) 11.41,9.37 11.43,9.37 arc(11.54,9.35) 11.62,9.29 11.64,9.27 arc(11.76,9.2) 11.89,9.17 12.15,9.17 arc(12.46,9.11) 12.73,8.93 arc(12.76,8.91) v1(12.8,8.9)
N_P1_TX_N: length 8.4
  Top Layer w0.14: 17.87,12.27 17.96,12.36 arc(18.01,12.39) 18.06,12.4 arc(17.94,12.38) 17.84,12.31 17.8,12.27 arc(17.75,12.19) 17.73,12.11 17.73,12.07 arc(17.72,12.02) 17.69,11.97 arc(17.64,11.94) 17.59,11.93 13.3,11.93 arc(13.13,11.97) 12.98,12.06 12.87,12.17 ; 12.87,12.17 arc(12.84,12.19) v1(12.8,12.2) arc(12.84,12.19) 12.87,12.17
  Bottom Layer w0.14: M.2.35 11.11,12.75 arc(11.19,12.73) 11.26,12.69 arc(11.33,12.65) 11.41,12.63 11.45,12.63 arc(11.58,12.61) 11.68,12.54 12.21,12 arc(12.29,11.95) 12.39,11.93 arc(12.48,11.95) 12.56,12 12.73,12.17 arc(12.76,12.19) v1(12.8,12.2)
N_P1_TX_P: length 8.4
  Top Layer w0.14: 17.87,11.33 17.96,11.24 arc(18.01,11.21) 18.06,11.2 arc(17.94,11.22) 17.84,11.29 17.8,11.33 arc(17.75,11.41) 17.73,11.49 17.73,11.53 arc(17.72,11.58) 17.69,11.63 arc(17.64,11.66) 17.59,11.67 13.3,11.67 arc(13.13,11.63) 12.98,11.53 12.87,11.43 ; 12.87,11.43 arc(12.84,11.41) v1(12.8,11.4) arc(12.84,11.41) 12.87,11.43
  Bottom Layer w0.14: M.2.37 11.11,12.25 arc(11.19,12.27) 11.26,12.31 arc(11.33,12.36) 11.4,12.37 arc(11.47,12.36) 11.53,12.31 12.07,11.78 arc(12.19,11.7) 12.33,11.67 arc(12.48,11.64) 12.6,11.56 12.73,11.43 arc(12.76,11.41) v1(12.8,11.4)
P0_RX_N: length 12.4
  Top Layer w0.14: JMS583.41 22.35,11.6 arc(22.3,11.59) 22.27,11.56 arc(22.23,11.54) 22.18,11.53 arc(21.98,11.49) 21.81,11.38 arc(21.46,11.14) 21.05,11.06 20.58,11.06 arc(20.22,10.99) 19.92,10.78 arc(19.82,10.72) 19.71,10.7 14.4,10.7 arc(14.23,10.74) 14.08,10.83 13.97,10.94 arc(13.94,10.96) v1(13.9,10.97)
  Bottom Layer w0.14: M.2.41 11.11,11.25 arc(11.19,11.23) 11.26,11.19 arc(11.33,11.15) 11.4,11.13 11.83,11.13 arc(12.11,11.07) 12.35,10.92 arc(12.59,10.76) 12.87,10.7 13.25,10.7 arc(13.56,10.76) 13.83,10.94 arc(13.86,10.96) v1(13.9,10.97)
P0_RX_P: length 12.4
  Top Layer w0.14: JMS583.42 22.35,11.2 arc(22.3,11.21) 22.27,11.23 arc(22.23,11.26) 22.18,11.27 arc(22.08,11.25) 22,11.19 arc(21.56,10.9) 21.05,10.8 20.58,10.8 arc(20.32,10.75) 20.1,10.6 arc(19.92,10.48) 19.71,10.44 19.32,10.44 ; 19.31,10.44 14.4,10.44 arc(14.23,10.4) 14.08,10.31 13.97,10.2 arc(13.94,10.18) v1(13.9,10.17)
  Bottom Layer w0.14: M.2.43 11.11,10.75 arc(11.19,10.77) 11.26,10.81 arc(11.33,10.85) 11.4,10.87 11.67,10.87 arc(12,10.8) 12.28,10.62 12.31,10.59 arc(12.47,10.48) 12.67,10.44 13.25,10.44 arc(13.56,10.38) 13.83,10.2 arc(13.86,10.18) v1(13.9,10.17)
P0_TX_N: length 4.2
  Top Layer w0.14: JMS583.44 22.35,10.4 arc(22.3,10.39) 22.27,10.36 arc(22.23,10.34) 22.18,10.33 21.93,10.33 arc(21.34,10.21) 20.84,9.88 20.72,9.75 arc(20.36,9.51) 19.94,9.43 19.61,9.43 arc(19.56,9.44) 19.51,9.47 arc(19.48,9.52) 19.47,9.57 19.47,9.61 arc(19.45,9.69) 19.4,9.77 19.36,9.81 arc(19.26,9.88) C14.1 arc(19.19,9.89) 19.24,9.86 19.31,9.79
P0_TX_P: length 4.2
  Top Layer w0.14: 19.31,8.81 19.24,8.74 arc(19.19,8.71) C15.1 arc(19.26,8.72) 19.36,8.79 19.4,8.83 arc(19.45,8.91) 19.47,8.99 19.47,9.03 arc(19.48,9.08) 19.51,9.13 arc(19.56,9.16) 19.61,9.17 19.99,9.17 arc(20.46,9.26) 20.86,9.53 20.95,9.62 arc(21.45,9.95) 22.04,10.07 22.18,10.07 arc(22.23,10.06) 22.27,10.03 arc(22.3,10.01) 22.35,10 JMS583.45
P1_RX_N: length 12.7
  Top Layer w0.14: JMS583.34 22.35,14.4 arc(22.3,14.39) 22.27,14.36 arc(22.23,14.34) 22.18,14.33 21.62,14.33 arc(20.55,14.12) 19.64,13.51 19.52,13.38 arc(19.31,13.25) 19.07,13.2 14.4,13.2 arc(14.23,13.24) 14.08,13.33 13.97,13.44 arc(13.94,13.46) v1(13.9,13.47)
  Bottom Layer w0.14: M.2.29 11.11,14.25 arc(11.19,14.23) 11.26,14.19 arc(11.33,14.15) 11.4,14.13 11.6,14.13 arc(11.86,14.08) 12.09,13.93 12.51,13.51 arc(12.85,13.28) 13.25,13.2 arc(13.56,13.26) 13.83,13.44 arc(13.86,13.46) v1(13.9,13.47)
P1_RX_P: length 12.7
  Top Layer w0.14: JMS583.35 22.35,14 arc(22.3,14.01) 22.27,14.03 arc(22.23,14.06) 22.18,14.07 21.62,14.07 arc(20.65,13.88) 19.83,13.33 19.7,13.2 arc(19.41,13.01) 19.07,12.94 14.4,12.94 arc(14.23,12.9) 14.08,12.81 13.97,12.7 arc(13.94,12.68) v1(13.9,12.67)
  Bottom Layer w0.14: M.2.31 11.11,13.75 arc(11.19,13.77) 11.26,13.81 arc(11.33,13.85) 11.4,13.87 11.55,13.87 arc(11.76,13.83) 11.94,13.71 12.33,13.32 arc(12.75,13.04) 13.25,12.94 arc(13.56,12.88) 13.83,12.7 arc(13.86,12.68) v1(13.9,12.67)
P1_TX_N: length 4.5
  Top Layer w0.14: JMS583.37 22.35,13.2 arc(22.3,13.19) 22.27,13.17 arc(22.23,13.14) 22.18,13.13 21.47,13.13 arc(20.88,12.89) 20.64,12.3 20.64,12.24 arc(20.54,12) 20.3,11.9 19.91,11.9 arc(19.89,11.9) 19.87,11.92 arc(19.86,11.93) 19.84,11.93 19.61,11.93 arc(19.56,11.94) 19.51,11.97 arc(19.48,12.02) 19.47,12.07 arc(19.45,12.19) 19.38,12.29 19.36,12.31 arc(19.26,12.38) C12.1
P1_TX_P: length 4.5
  Top Layer w0.14: JMS583.38 22.35,12.8 arc(22.3,12.81) 22.27,12.83 arc(22.23,12.86) 22.18,12.87 21.47,12.87 arc(21.07,12.7) 20.9,12.3 20.9,12.24 arc(20.72,11.82) 20.3,11.64 19.8,11.64 arc(19.78,11.64) 19.77,11.66 arc(19.75,11.67) 19.73,11.67 19.61,11.67 arc(19.56,11.66) 19.51,11.63 arc(19.48,11.58) 19.47,11.53 arc(19.45,11.41) 19.38,11.31 19.36,11.29 arc(19.26,11.22) C13.1
PCIE_CLK: length 24.1
  Top Layer w0.15: R3.1 11.75,9.2 11.94,9 11.94,8.93 14.02,6.85 15.25,6.85 16.4,5.7 20.2,5.7 v1(20.9,6.4) ; JMS583.55 v1(26,8.7)
  Bottom Layer w0.15: M.2.52 18.03,8.42 17.71,8.42 17.53,8.24 17.53,6.76 18.21,6.07 20.49,6.07 20.82,6.4 v1(20.9,6.4) 20.98,6.4 21.31,6.07 23.37,6.07 v1(26,8.7)
PCIE_RST: length 19.4
  Top Layer w0.15: 11.75,8 11.75,8 12.15,8 v1(12.8,7.35) ; JMS583.54 25.6,7.12 25.8,6.92 v1(25.8,6.8)
  Bottom Layer w0.15: 17.25,6.64 18.1,5.8 23.6,5.8 24.6,6.8 v1(25.8,6.8) ; 17.25,6.64 17.25,8.47 17.71,8.92 18.03,8.92 M.2.50 ; 17.25,6.64 14.22,6.64 13.52,7.35 v1(12.8,7.35)
RST: length 5.2
  Top Layer w0.2: JMS583.15 32.15,14.4 32.55,14.8 C9.2 34.07,14.83 R2.2
RX1_N: length 26.4
  Top Layer w0.125: JMS583.27 25.6,16.05 arc(25.61,16.1) 25.64,16.14 arc(25.67,16.18) 25.68,16.23 arc(25.66,16.31) 25.62,16.37 25.14,16.86 arc(24.31,17.41) 23.34,17.6 22.85,17.6 arc(21.88,17.41) 21.06,16.86 19.9,15.7 arc(19.19,15.22) 18.34,15.06 15.7,15.06 ; 15.7,15.06 14.13,15.06 arc(13.18,14.87) 12.37,14.33 arc(11.88,13.99) 11.29,13.88 9.4,13.88 arc(9.22,13.84) 9.07,13.74 8.95,13.62 arc(8.93,13.61) v1(8.9,13.6) ; 15.7,15.06 15.9,15.06
  Bottom Layer w0.125: USB1.A3 arc(1.89,13.84) 1.98,13.88 8.4,13.88 arc(8.58,13.84) 8.73,13.74 8.85,13.62 arc(8.87,13.61) v1(8.9,13.6)
RX1_P: length 26.6
  Top Layer w0.125: JMS583.26 26,16.05 arc(25.99,16.1) 25.96,16.14 arc(25.93,16.18) 25.92,16.23 arc(25.89,16.4) 25.79,16.55 25.31,17.03 arc(24.41,17.63) 23.34,17.84 22.85,17.84 arc(21.79,17.63) 20.88,17.03 19.73,15.87 arc(19.09,15.45) 18.34,15.3 14.13,15.3 arc(13.09,15.09) 12.2,14.5 arc(11.78,14.22) 11.29,14.12 9.4,14.12 arc(9.22,14.16) 9.07,14.26 8.95,14.38 arc(8.93,14.39) v1(8.9,14.4)
  Bottom Layer w0.125: v1(8.9,14.4) arc(8.87,14.39) 8.85,14.38 8.73,14.26 arc(8.58,14.16) 8.4,14.12 1.98,14.12 arc(1.89,14.16) USB1.A2
RX2_N: length 27.8
  Top Layer w0.125: 22.99,17.34 23.06,17.34 arc(24.11,17.14) 24.99,16.55 arc(25.09,16.4) 25.12,16.23 arc(25.13,16.18) 25.16,16.14 arc(25.19,16.1) 25.2,16.05 JMS583.28 ; USB1.B3 arc(1.89,10.16) 1.98,10.12 9.88,10.12 arc(11.13,10.64) 11.66,11.9 11.66,12.02 arc(12.47,13.98) 14.44,14.8 18.3,14.8 arc(19.27,14.99) 20.1,15.54 21.15,16.59 arc(21.98,17.15) 22.96,17.34
RX2_P: length 27.4
  Top Layer w0.125: JMS583.29 24.8,16.05 arc(24.81,16.1) 24.84,16.14 arc(24.87,16.18) 24.88,16.23 arc(24.86,16.31) 24.82,16.37 arc(24.01,16.91) 23.06,17.1 22.98,17.1 arc(22.07,16.92) 21.31,16.41 20.27,15.37 arc(19.37,14.77) 18.3,14.56 14.44,14.56 arc(12.64,13.81) 11.9,12.02 11.9,11.8 arc(11.34,10.44) 9.98,9.88 1.98,9.88 arc(1.89,9.84) USB1.B2
TX1_N: length 10.9
  Top Layer w0.125: 26.63,17.97 26.77,17.83 ; 26.63,17.97 26.17,18.43 arc(25.34,18.98) 24.37,19.18 19.6,19.18 arc(19.55,19.17) 19.51,19.14 arc(19.49,19.1) 19.48,19.05 19.48,19.01 arc(19.46,18.92) 19.41,18.84 19.36,18.79 arc(19.26,18.72) C6.2 ; 26.63,17.97 27.31,17.29 arc(27.58,16.88) 27.68,16.4 27.68,16.23 arc(27.67,16.18) 27.64,16.14 arc(27.61,16.1) 27.6,16.05 JMS583.22
TX1_P: length 11.1
  Top Layer w0.125: JMS583.21 28,16.05 arc(27.99,16.1) 27.96,16.14 arc(27.93,16.18) 27.92,16.23 27.92,16.4 arc(27.81,16.98) 27.48,17.47 26.34,18.61 arc(25.44,19.21) 24.37,19.42 19.6,19.42 arc(19.55,19.43) 19.51,19.46 arc(19.49,19.5) 19.48,19.55 19.48,19.59 arc(19.46,19.68) 19.41,19.76 19.36,19.81 arc(19.26,19.88) C7.2
TX2_N: length 10.4
  Top Layer w0.125: JMS583.23 27.2,16.05 arc(27.19,16.1) 27.16,16.14 arc(27.13,16.18) 27.12,16.23 27.12,16.4 arc(26.99,17.07) 26.61,17.64 26.27,17.97 arc(25.86,18.25) 25.38,18.34 22.6,18.34 arc(21.53,18.13) 20.63,17.53 20.42,17.32 ; 20.42,17.32 arc(20.09,17.1) 19.7,17.02 19.6,17.02 arc(19.55,17.03) 19.51,17.06 arc(19.49,17.1) 19.48,17.15 19.48,17.19 arc(19.46,17.28) 19.41,17.36 19.36,17.41 arc(19.26,17.48) C11.2
TX2_P: length 10
  Top Layer w0.125: JMS583.24 26.8,16.05 arc(26.81,16.1) 26.84,16.14 arc(26.87,16.18) 26.88,16.23 26.88,16.4 arc(26.76,16.98) 26.44,17.46 26.1,17.8 arc(25.77,18.02) 25.38,18.1 22.6,18.1 arc(21.63,17.91) 20.8,17.36 20.59,17.15 arc(20.18,16.87) 19.7,16.78 19.6,16.78 arc(19.55,16.77) 19.51,16.74 arc(19.49,16.7) 19.48,16.65 19.48,16.61 arc(19.46,16.52) 19.41,16.44 19.36,16.39 arc(19.26,16.32) C10.2
U_CC1: length 9.4
  Top Layer w0.15: v1(4.8,8.5) 5.3,8 R12.1
  VCC w0.15: v1(4.8,8.5) 4.11,9.19 4.11,12.39 4.3,12.59 v1(4.3,13.3)
  Bottom Layer w0.15: v1(4.3,13.3) 4.22,13.3 3.67,12.75 USB1.A5
U_CC2: length 5.8
  Top Layer w0.15: USB1.B5 2.75,11.25 2.77,11.27 3.53,11.27 4.02,10.78 4.82,10.78 v1(4.9,10.7) ; v1(5.2,9.3) 6.03,9.3 R13.1
  VCC w0.15: v1(4.9,10.7) 4.9,9.71 5.2,9.41 v1(5.2,9.3)
U_TX1_N: length 20.2
  Top Layer w0.125: 12.1,19.18 9.62,19.18 arc(8.08,18.54) 7.44,17 7.44,15.92 arc(6.85,14.48) 5.4,13.88 1.98,13.88 arc(1.89,13.84) USB1.B10 ; 12.1,19.18 12.3,19.18 ; 12.1,19.18 17.6,19.18 arc(17.65,19.17) 17.69,19.14 arc(17.71,19.1) 17.72,19.05 17.72,19.01 arc(17.74,18.92) 17.79,18.84 17.84,18.79 arc(17.94,18.72) 18.06,18.7
U_TX1_P: length 20
  Top Layer w0.125: USB1.B11 arc(1.89,14.16) 1.98,14.12 5.4,14.12 arc(6.67,14.65) 7.2,15.92 7.2,17 arc(7.91,18.71) 9.62,19.42 17.6,19.42 arc(17.65,19.43) 17.69,19.46 arc(17.71,19.5) 17.72,19.55 17.72,19.59 arc(17.74,19.68) 17.79,19.76 17.84,19.81 arc(17.94,19.88) 18.06,19.9
U_TX2_N: length 21.7
  Top Layer w0.14: v1(7.27,12.7) arc(7.29,12.82) 7.36,12.91 7.47,13.02 arc(7.52,13.1) 7.54,13.2 7.54,14.23 arc(8.36,16.21) 10.34,17.03 17.59,17.03 arc(17.64,17.04) 17.69,17.07 arc(17.72,17.12) 17.73,17.17 17.73,17.21 arc(17.75,17.29) 17.8,17.37 17.84,17.41 arc(17.94,17.48) 18.06,17.5
  Bottom Layer w0.14: v1(7.27,12.7) arc(7.28,12.66) 7.3,12.63 7.41,12.52 arc(7.51,12.37) 7.54,12.2 7.54,11.84 arc(7.04,10.63) 5.83,10.13 1.97,10.13 arc(1.89,10.17) USB1.A10
U_TX2_P: length 21.7
  Top Layer w0.14: v1(8.07,12.7) arc(8.05,12.81) 7.98,12.91 7.87,13.02 arc(7.82,13.1) 7.8,13.2 7.8,14.23 arc(8.54,16.03) 10.34,16.77 17.59,16.77 arc(17.64,16.76) 17.69,16.73 arc(17.72,16.68) 17.73,16.63 17.73,16.59 arc(17.75,16.51) 17.8,16.43 17.84,16.39 arc(17.94,16.32) 18.06,16.3
  Bottom Layer w0.14: v1(8.07,12.7) arc(8.06,12.66) 8.04,12.63 7.93,12.52 arc(7.83,12.37) 7.8,12.2 7.8,11.84 arc(7.22,10.45) 5.83,9.87 1.97,9.87 arc(1.89,9.83) USB1.A11
XIN: length 9.4
  Top Layer w0.15: X1.1 20.4,2.95 21.4,3.95 21.4,5.4 21.7,5.7 23,5.7 23.97,6.67 23.97,7.78 JMS583.50
  Top Layer w0.2: C8.2 19.39,3.75 20.2,2.95 X1.1
XOUT: length 5.6
  Top Layer w0.15: X1.3 22.6,4.65 23.12,5.17 23.12,5.28 24.4,6.55 JMS583.51
  Top Layer w0.2: 22.6,4.65 23.93,4.65 24.1,4.82 C2.2
$1N3363: length 1.5
  Bottom Layer w0.15: R6.2 6.27,15.44 SSD_P.2
$1N3561: length 1.5
  Bottom Layer w0.15: 5.67,7.9 5.67,6.42 Work.1
$1N4495: length 2
  Top Layer w0.2: JMS583.39 21.84,12.4 arc(21.77,12.39) 21.71,12.37 v1(21.59,12.32)
  Bottom Layer w0.2: 20.63,12.2 21.29,12.2 arc(21.45,12.23) v1(21.59,12.32)
$1N10279: length 7.8
  Top Layer w0.2: 38.1,4.13 38.2,4.23 38.2,4.6 39.2,5.6 39.2,8.05 39.75,8.6 U8.5 ; 38.1,4.13 36.9,4.13 ; 38.1,4.13 39.21,4.13 C22.2
$1N10953: length 1.5
  Bottom Layer w0.15: R4.2 6.27,19.94 Power.2
$1N11540: length 7.8
  Top Layer w0.2: R10.1 39.21,16.73 C21.2 ; R10.1 38.1,17.2 39.2,18.3 39.2,20.65 39.75,21.2 U7.5 ; R10.1 R8.2
$1N22897: length 3.5
  Top Layer w0.3: v1(32.2,20.4) 32.18,20.38 32.18,19.38 U9.1
  Bottom Layer w0.3: 30.6,19.15 30.72,19.27 30.72,19.72 31.34,20.34 32.14,20.34 v1(32.2,20.4)
$1N22946: length 4.7
  Top Layer w0.3: U9.4 U9.5 32.15,17.97 32.4,18.22 v1(32.4,18.3)
  Bottom Layer w0.3: C56.1 31.84,18.31 32.96,18.31 R16.2
$1N23051: length 21.1
  Top Layer w0.2: v1(33.5,20.4) 32.98,20.92 31.56,20.92 30.25,19.61 U9.3 ; Q2.1 48.12,21.35 47.88,21.1 47.88,20.84 47.57,20.53 R15.2 v1(47,21.5)
  Bottom Layer w0.2: v1(47,21.5) 45.9,20.4 v1(33.5,20.4)

## Copper pours and planes (outline as drawn; the poured copper is in the pictures)
3V3 on Top Layer: 34.3,5 44.9,5 44.9,0.7 34.3,0.7
AVDDL on Top Layer: 37.8,17.6 44.9,17.6 44.9,13.8 37.8,13.8
AVDDL on Top Layer: 28.5,4.1 33.2,4.1 33.2,2.3 28.5,2.3
AVDDL on VCC: 30.7,3.8 32.1,3.8 32.1,2.8 30.7,2.8
GND on Top Layer: 40.4,8 44.9,8 44.9,5.2 40.4,5.2
GND on Top Layer: 40.4,20.6 44.9,20.6 44.9,17.8 40.4,17.8
GND on Top Layer: 1.08,9.25 2.67,9.25 2.67,6.2 1.08,6.2
GND on Top Layer: 1.08,17.9 2.67,17.9 2.67,14.75 1.08,14.75
GND on Bottom Layer: 1.08,17.9 2.67,17.9 2.67,14.75 1.08,14.75
GND on Bottom Layer: 1.08,9.25 2.67,9.25 2.67,6.2 1.08,6.2
VBUS on Top Layer: 46.5,19.95 49.03,19.95 49.03,17.45 46.5,17.45
VBUS on Top Layer: 32.9,19.4 34.4,19.4 34.4,17.35 32.9,17.35
VBUS on Top Layer: 40.55,10.33 44.95,10.33 44.95,7.92 40.55,7.92
VBUS on Top Layer: 30.2,8.9 34.6,8.9 34.6,5.9 30.2,5.9
VBUS on Top Layer: 30.2,16.1 31.5,16.1 31.5,14.7 30.2,14.7
VBUS on Top Layer: 40.55,23 44.95,23 44.95,20.53 40.55,20.53
VBUS on VCC: 41.6,22.6 45.1,22.6 45.1,20.1 41.6,20.1
VCC on Top Layer: 28.15,18.35 28.9,18.35 28.9,15.8 28.15,15.8
LXO on Top Layer: 28.6,8.2 30.5,8.2 30.5,4.4 28.6,4.4
M.2_3V3 on Top Layer: 30,2.1 33.5,2.1 33.5,0.7 30,0.7
M.2_3V3 on Bottom Layer: 17.7,4.16 21.4,4.16 21.4,0.3 17.7,0.3
M.2_3V3 on Bottom Layer: 16.2,18.9 18.5,18.9 18.5,16.8 16.2,16.8
M.2_3V3 on Bottom Layer: 17.7,22.1 21.3,22.1 21.3,20.3 17.7,20.3
M.2_3V3 on VCC: 15.3,19.1 21.5,19.1 21.5,0.3 15.3,0.3
M.2_3V3 on VCC: 15.9,22.1 21.3,22.1 21.3,17.1 15.9,17.1
M.2_3V3 on VCC: 17.7,2.2 32.4,2.2 32.4,0.3 17.7,0.3
$1N10317 on Top Layer: 40,7.1 42.2,7.1 42.2,4.4 40,4.4
$1N11538 on Top Layer: 40,19.7 42.2,19.7 42.2,17 40,17
$1N23334 on Top Layer: 49.78,21.94 56.9,21.94 56.9,18.8 49.78,18.8

Small or netless copper shapes (teardrops, artwork), in the pictures only: 171 on Top Layer, 91 on Bottom Layer, 1 on GND, 18 on VCC

## Text on the board
Bottom Silkscreen Layer: Designed By | 2230 | 2242 | 2280
Mechanical Layer: 0,9 | 13,5 | 30 | 42 | 99,1 | 94,1 | 80 | R2,5 | ?4 | 6,1 | 19 | 24 | ?2,05
Top Silkscreen Layer: + | -
